# Altium project Power_PCB.PrjPcb
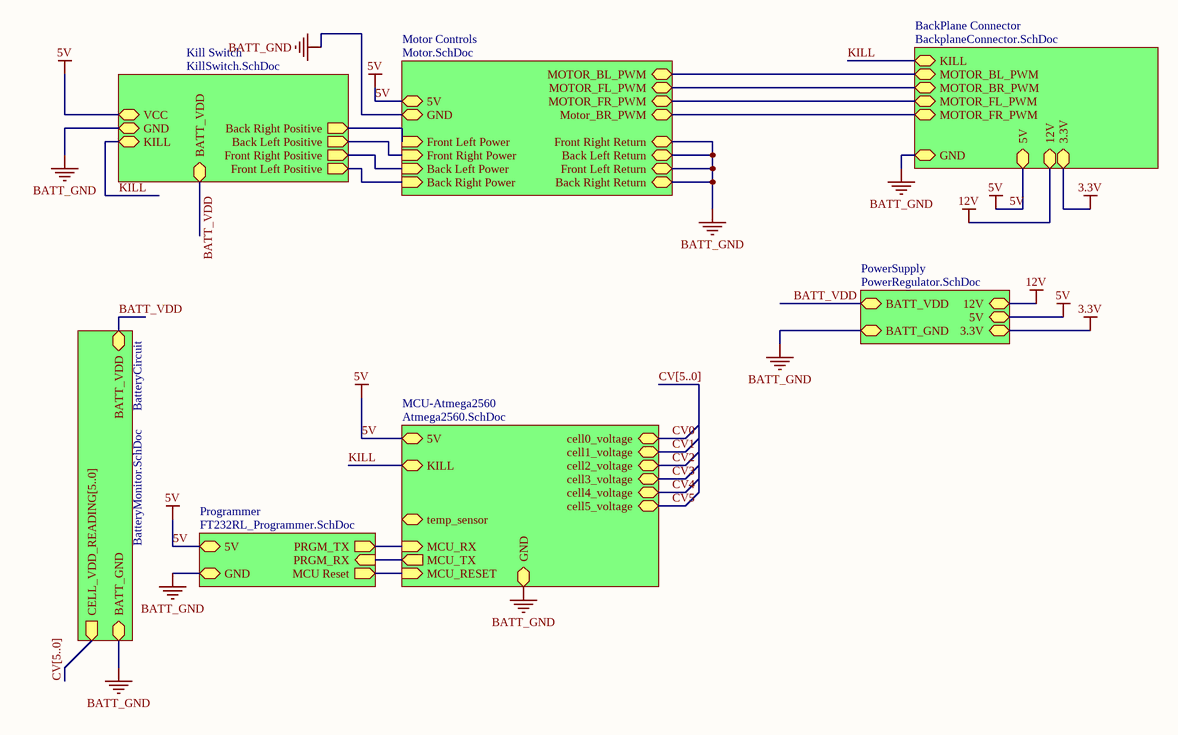
[diagram p0: Backplane.SchDoc]
11 sheets, 95 parts. Net scope: strictly hierarchical (ports join the sheet entries above them; power ports are local).
Board file: Backplane.PcbDoc
Sheets:
  Backplane.SchDoc
    Kill Switch = KillSwitch.SchDoc
    Motor Controls = Motor.SchDoc
    Programmer = FT232RL_Programmer.SchDoc
    BatteryCircuit = BatteryMonitor.SchDoc
    BackPlane Connector = BackplaneConnector.SchDoc
    MCU-Atmega2560 = Atmega2560.SchDoc
    PowerSupply = PowerRegulator.SchDoc
      U_VoltageRegulator12V = VoltageRegulator12V.schdoc
      U_VoltageRegulator3 = VoltageRegulator3.3.schdoc
      U_VoltageRegulator5V = VoltageRegulator5V.schdoc

## Sheet Backplane.SchDoc
size A4; SheetNumber: 1; SheetTotal: 2

### Sub-sheets
BackPlane Connector = BackplaneConnector.SchDoc: MOTOR_BL_PWM, MOTOR_BR_PWM, MOTOR_FL_PWM, MOTOR_FR_PWM, GND, 5V, KILL, 12V, 3.3V
BatteryCircuit = BatteryMonitor.SchDoc: BATT_VDD, BATT_GND, CELL_VDD_READING[5..0] (out)
Kill Switch = KillSwitch.SchDoc: Front Left Positive (out), Front Right Positive (out), Back Left Positive (out), Back Right Positive (out), VCC, GND, KILL (bidir), BATT_VDD
MCU-Atmega2560 = Atmega2560.SchDoc: 5V, GND, cell0_voltage (bidir), cell1_voltage (bidir), cell2_voltage (bidir), cell3_voltage (bidir), cell4_voltage (bidir), cell5_voltage (bidir), temp_sensor (bidir), MCU_TX (out), MCU_RX (in), MCU_RESET (in), KILL (bidir)
Motor Controls = Motor.SchDoc: Back Right Power (in), Back Left Power (in), Front Right Power (in), Front Left Power (in), Front Right Return, Back Left Return, Front Left Return, Back Right Return, 5V, MOTOR_BL_PWM, MOTOR_FL_PWM, MOTOR_FR_PWM, Motor_BR_PWM, GND
PowerSupply = PowerRegulator.SchDoc: BATT_VDD, 12V, 5V, 3.3V, BATT_GND
Programmer = FT232RL_Programmer.SchDoc: GND, PRGM_TX (out), PRGM_RX (in), MCU Reset (out), 5V

### Nets
3.3V: sheet BackPlane Connector/3.3V, sheet PowerSupply/3.3V
5V: sheet Kill Switch/VCC, sheet Motor Controls/5V, sheet Programmer/5V, sheet BackPlane Connector/5V, sheet MCU-Atmega2560/5V, sheet PowerSupply/5V
12V: sheet BackPlane Connector/12V, sheet PowerSupply/12V
BATT_GND: sheet Kill Switch/GND, sheet Motor Controls/Front Right Return, sheet Motor Controls/Back Left Return, sheet Motor Controls/Front Left Return, sheet Motor Controls/Back Right Return, sheet Motor Controls/GND, sheet Programmer/GND, sheet BatteryCircuit/BATT_GND, sheet BackPlane Connector/GND, sheet MCU-Atmega2560/GND, sheet PowerSupply/BATT_GND  [project net GND]
BATT_VDD: sheet Kill Switch/BATT_VDD, sheet BatteryCircuit/BATT_VDD, sheet PowerSupply/BATT_VDD
KILL: sheet Kill Switch/KILL, sheet BackPlane Connector/KILL, sheet MCU-Atmega2560/KILL
Motor_BL_Postive: sheet Kill Switch/Back Left Positive, sheet Motor Controls/Front Right Power
MOTOR_BL_PWM: sheet Motor Controls/MOTOR_BL_PWM, sheet BackPlane Connector/MOTOR_BL_PWM
Motor_BR_Postive: sheet Kill Switch/Back Right Positive, sheet Motor Controls/Front Left Power
MOTOR_BR_PWM: sheet Motor Controls/MOTOR_FL_PWM, sheet BackPlane Connector/MOTOR_BR_PWM
Motor_FL_Postive: sheet Kill Switch/Front Left Positive, sheet Motor Controls/Back Right Power
MOTOR_FL_PWM: sheet Motor Controls/MOTOR_FR_PWM, sheet BackPlane Connector/MOTOR_FL_PWM
Motor_FR_Postive: sheet Kill Switch/Front Right Positive, sheet Motor Controls/Back Left Power
MOTOR_FR_PWM: sheet Motor Controls/Motor_BR_PWM, sheet BackPlane Connector/MOTOR_FR_PWM
NetATmega2560_2: sheet Programmer/PRGM_RX, sheet MCU-Atmega2560/MCU_TX
NetATmega2560_3: sheet Programmer/PRGM_TX, sheet MCU-Atmega2560/MCU_RX
NetATmega2560_30: sheet Programmer/MCU Reset, sheet MCU-Atmega2560/MCU_RESET

### Buses and harness runs
bus CV[5..0]
bus CV[5..0] = sheet BatteryCircuit/CELL_VDD_READING[5..0]

### Notes on the sheet
- Title
- Size:
- Date:
- A4
- Number:
- Time:
- Revision:
- Sheet
- of
- File:

## Sheet KillSwitch.SchDoc: Kill Switch Circuit
size A4; Date: 4/20/2017; DrawnBy: Michael Fay; Revision: 1; SheetNumber: 2; SheetTotal: 2; File: KillSwitch.SchDoc
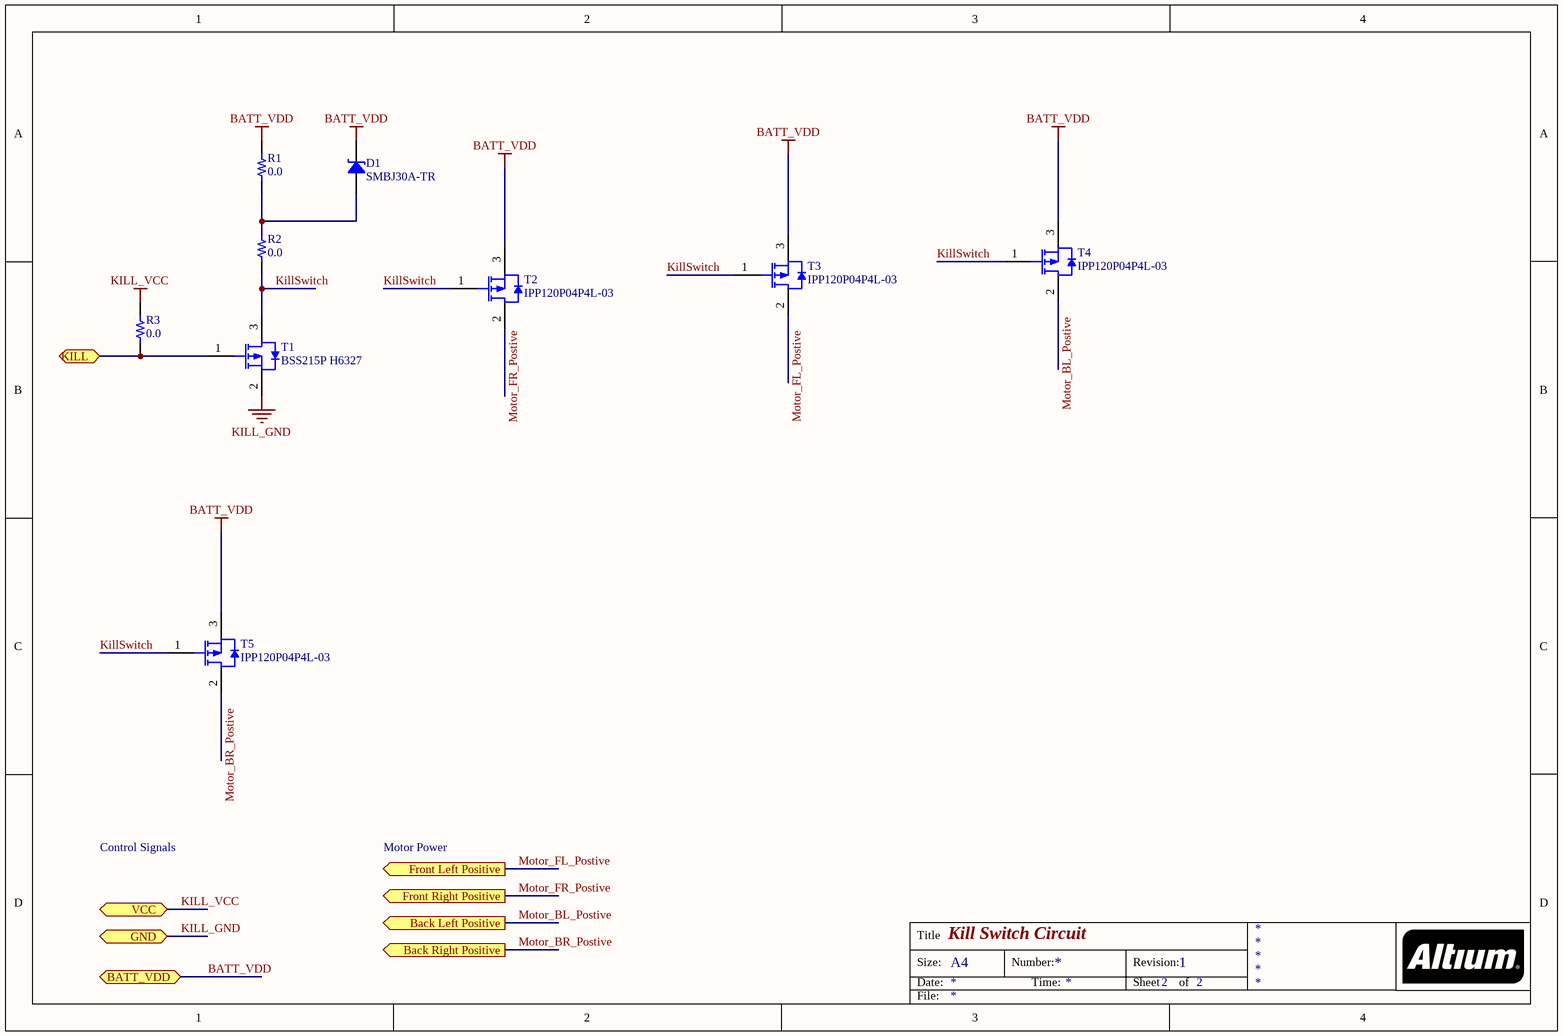
[diagram p1: KillSwitch.SchDoc]

### Parts
D1  SMBJ30A-TR  [ST DO214AA SMB]
R1  0.0  [RES 0603/1608]
R2  0.0  [RES 0603/1608]
R3  0.0  [RES 0603/1608]
T1  BSS215P H6327  [INF-PG-SOT23_N]
T2  IPP120P04P4L-03  [INF-PG-TO220-3-1]
T3  IPP120P04P4L-03  [INF-PG-TO220-3-1]
T4  IPP120P04P4L-03  [INF-PG-TO220-3-1]
T5  IPP120P04P4L-03  [INF-PG-TO220-3-1]

### Ports
Back Left Positive (out), Back Right Positive (out), BATT_VDD, Front Left Positive (out), Front Right Positive (out), GND, KILL (bidir), VCC

### Nets
BATT_VDD: D1.2 R1.2 T2.3(SOURCE) T3.3(SOURCE) T4.3(SOURCE) T5.3(SOURCE) ; port BATT_VDD
KILL_GND: T1.2(SOURCE) ; port GND  [project net GND]
KILL_VCC: R3.2 ; port VCC  [project net 5V]
KILL: R3.1 T1.1(GATE) ; port KILL
KillSwitch: R2.1 T1.3(DRAIN) T2.1(GATE) T3.1(GATE) T4.1(GATE) T5.1(GATE)
Motor_BL_Postive: T4.2(DRAIN) ; port Back Left Positive
Motor_BR_Postive: T5.2(DRAIN) ; port Back Right Positive
Motor_FL_Postive: T3.2(DRAIN) ; port Front Left Positive
Motor_FR_Postive: T2.2(DRAIN) ; port Front Right Positive
NetD1_1: D1.1 R1.1 R2.2

### Notes on the sheet
- Control Signals
- Motor Power
- Title
- Size:
- Date:
- A4
- Number:
- Time:
- Revision:
- Sheet
- of
- File:

### Library data of the parts
D1 = SMBJ30A-TR: TVS DIODE 30VWM 64.3VC SMB; Manufacturer: STMicroelectronics; Type: Zener; Unidirectional Channels: 1; Power - Peak Pulse: 600W; Current - Peak Pulse: 62A (8/20us); Voltage (Clamping): 64.3V; Voltage (Breakdown): 33.3V; Voltage (Reverse Standoff): 30V; Part Number: SMBJ30A-TR; PartId: 14620; Supplier 1: Digi-Key; Supplier Part Number 1: 497-7452-2-ND; ComponentLink1Description: Datasheet; ComponentLink1URL: http://www2.st.com/content/ccc/resource/technical/document/datasheet/19/78/91/39/07/cd/40/65/CD00001366.pdf/files/CD00001366.pdf/_jcr_content/translations/en.CD00001366.pdf; ComponentLink2Description: Digi-Key Listing; ComponentLink2URL: https://www.digikey.com/product-detail/en/stmicroelectronics/SMBJ30A-TR/497-7452-2-ND/1039140; Operating Temperature: -55C ~ 150C (TJ); Price: 0.09; Device Package: DO-214AA, SMB
R1-R3 = 5110: RES SMD 0.0 OHM JUMPER 1/2W 0603; Part Number: 5110; Manufacturer: Keystone Electronics; PowerRating: 0.5W, 1/2W; Value: 0.0; PartId: 16115; Supplier 1: Digi-Key; Supplier Part Number 1: 36-5110TR-ND; ComponentLink1Description: Datasheet; ComponentLink1URL: http://www.keyelco.com/product-pdf.cfm?p=14038; ComponentLink2Description: Digi-Key Listing; ComponentLink2URL: https://www.digikey.com/product-detail/en/keystone-electronics/5110/36-5110TR-ND/5118870; Tolerance: Jumper; Price: 0.2505; Device Package: 0603 (1608 Metric)
T1 = BSS215P H6327: P-Channel OptiMOS P2 Small-Signal-Transistor, -20 V VDS, -1.5 A ID, -55 to 150 degC, PG-SOT23, Reel, Green; Manufacturer: Infineon; Green: TRUE; ID (max): -1.5 A; IDpuls (max): -6 A; Pto t (max): 0.5 W; QG: -3.6 nC; RDS (on) (max): 280 mOhm; RDS (on) (max) (@4.5V): 150 mOhm; Rth: 250 K/W; VDS (max): -20 V; VGS(th) (max): -0.6 V; VGS(th) (min): -1.2 V; DatasheetVersion: Rev. 2.3; PackageVersion: Apr-08; PackageReference: PG-SOT23; PackageDescription: 3-Pin Small Outline Transistor Package, 2.9 x 1.3 mm Body, 0.95 mm Pitch; Supplier 1: Digi-Key; Supplier Part Number 1: BSS215P H6327TR-ND; Supplier 2: Digi-Key; Supplier Part Number 2: BSS215P H6327CT-ND; Supplier 3: Digi-Key; Supplier Part Number 3: BSS215P H6327DKR-ND; Halogen-free: TRUE; Packing: Reel; RDS (on) (max) (@2.5V): 280 mOhm; Mounting Technology: Surface Mount; PartNumber: BSS215P H6327; ComponentLink1Description: Manufacturer URL; ComponentLink1URL: http://www.infineon.com/; ComponentLink2Description: Datasheet; ComponentLink2URL: http://www.infineon.com/dgdl/BSS215P_Rev2.3.pdf?folderId=db3a304314dca38901154a72e3951a65&fileId=db3a304330f6860601311833f57144fb; ComponentLink3Description: Package Specification; ComponentLink3URL: http://www.infineon.com/dgdl/SOT23-Package_Overview.pdf?folderId=db3a30431936bc4b0119532290053c66&fileId=db3a30431936bc4b0119533468123c85
T2-T5 = IPP120P04P4L-03: OptiMOS-P2 Power-Transistor, -40 V VDS, -120 A ID, PG-TO220-3-1, Tube, Green; Manufacturer: Infineon; Green: TRUE; ID (max): -120 A; IDpuls (max): -480 A; Ptot (max): 136 W; QG: 180 nC; RDS (on) (max) (@10V): 3.4 mOhm; RDS (on) (max) (@4.5V): 5.2 mOhm; RthJC (max): 1.1 K/W; VDS (max): -40 V; VGS(th) (max): -2.2 V; VGS(th) (min): -1.2 V; DatasheetVersion: Rev. 1.0; PackageVersion: Jul-12; PackageReference: PG-TO220-3-1; PackageDescription: 3-Pin Plastic (Green) Transistor Single Outline Package, 10 x 9.25 mm Body, 2.54 mm Pitch; Supplier 1: Mouser; Supplier Part Number 1: 726-IPP120P04P4L-03; Halogen-free: TRUE; Packing: Tube; Technology: OptiMOS-P2; Mounting Technology: Through Hole; PartNumber: IPP120P04P4L-03; ComponentLink1Description: Manufacturer URL; ComponentLink1URL: http://www.infineon.com/; ComponentLink2Description: Datasheet; ComponentLink2URL: http://www.infineon.com/dgdl/IPP_B_I120P04P4L-03_DS_10.pdf?folderId=db3a304412b407950112b42b75b74520&fileId=db3a30432f69f146012f783b3b5a2e3f&location=en.Products.Automotive_ICs.Automotive_MOSFETs.Single__P-Channel_40V_MOSFETs.DATASHEET.IPP_B_I120P04P4L-03_DS_10.pdf; ComponentLink3Description: Package Specification; ComponentLink3URL: http://www.infineon.com/dgdl/BTS117_DS_14.pdf?folderId=db3a30431400ef68011421b54e2e0564&fileId=db3a30433a747525013abff8302d549c&location=en.Products.Automotive_ICs.Smart_High-_and_Low-Side_Switches.HITFET___TEMPFET__-_Smart_Low-Side_Switches.DATASHEET.BTS117_DS_14.pdf

## Sheet Motor.SchDoc
size A4
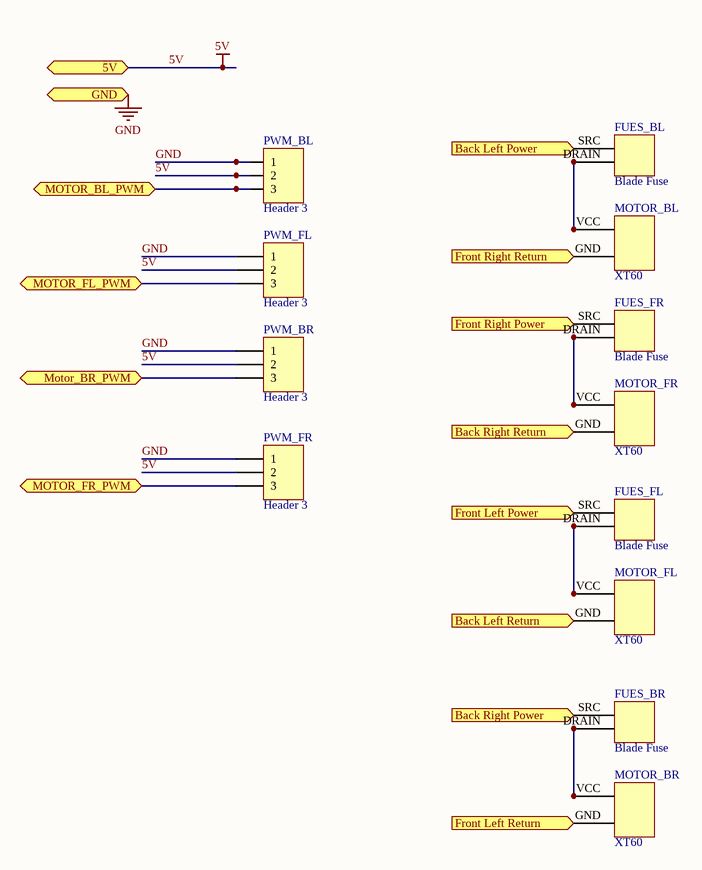
[diagram p2: Motor.SchDoc]

### Parts
FUES_BL  Blade Fuse  [Blade Fuse Holder]
FUES_BR  Blade Fuse  [Blade Fuse Holder]
FUES_FL  Blade Fuse  [Blade Fuse Holder]
FUES_FR  Blade Fuse  [Blade Fuse Holder]
MOTOR_BL  XT60  [XT60]
MOTOR_BR  XT60  [XT60]
MOTOR_FL  XT60  [XT60]
MOTOR_FR  XT60  [XT60]
PWM_BL  Header 3  [HDR1X3]
PWM_BR  Header 3  [HDR1X3]
PWM_FL  Header 3  [HDR1X3]
PWM_FR  Header 3  [HDR1X3]

### Ports
5V, Back Left Power, Back Left Return, Back Right Power, Back Right Return, Front Left Power, Front Left Return, Front Right Power, Front Right Return, GND, MOTOR_BL_PWM, Motor_BR_PWM, MOTOR_FL_PWM, MOTOR_FR_PWM

### Nets
5V: PWM_BL.2 PWM_BR.2 PWM_FL.2 PWM_FR.2 ; port 5V
GND: MOTOR_BL.GND MOTOR_BR.GND MOTOR_FL.GND MOTOR_FR.GND PWM_BL.1 PWM_BR.1 PWM_FL.1 PWM_FR.1 ; port Front Right Return, port Back Left Return, port Front Left Return, port Back Right Return, port GND
Motor_BL_Postive: FUES_FR.SRC ; port Front Right Power
MOTOR_BL_PWM: PWM_BL.3 ; port MOTOR_BL_PWM
Motor_BR_Postive: FUES_FL.SRC ; port Front Left Power
MOTOR_BR_PWM: PWM_FL.3 ; port MOTOR_FL_PWM
Motor_FL_Postive: FUES_BR.SRC ; port Back Right Power
MOTOR_FL_PWM: PWM_FR.3 ; port MOTOR_FR_PWM
Motor_FR_Postive: FUES_BL.SRC ; port Back Left Power
MOTOR_FR_PWM: PWM_BR.3 ; port Motor_BR_PWM
NetFUES_BL_DRAIN: FUES_BL.DRAIN MOTOR_BL.VCC
NetFUES_BR_DRAIN: FUES_BR.DRAIN MOTOR_BR.VCC
NetFUES_FL_DRAIN: FUES_FL.DRAIN MOTOR_FL.VCC
NetFUES_FR_DRAIN: FUES_FR.DRAIN MOTOR_FR.VCC

### Notes on the sheet
- Title
- Size:
- Date:
- A4
- Number:
- Time:
- Revision:
- Sheet
- of
- File:

### Library data of the parts
PWM_BL PWM_BR PWM_FL PWM_FR = Header 3: Header, 3-Pin; LatestRevisionDate: 17-Jul-2002; LatestRevisionNote: Re-released for DXP Platform.; Publisher: Altium Limited

## Sheet FT232RL_Programmer.SchDoc
size A4
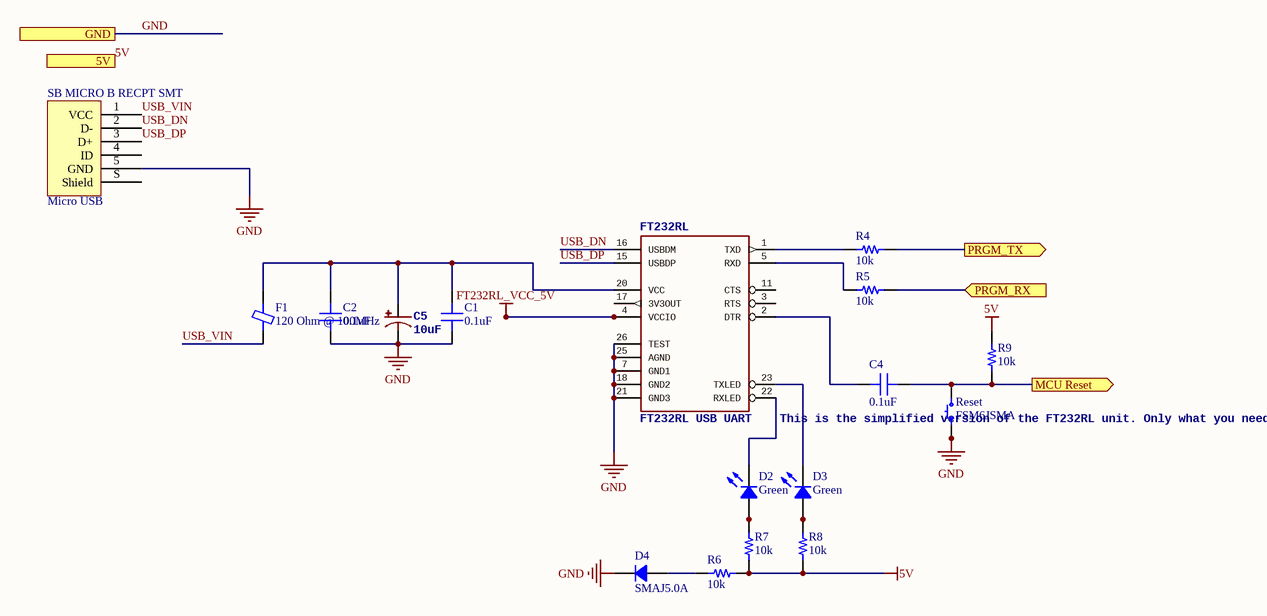
[diagram p3: FT232RL_Programmer.SchDoc]

### Parts
C1  0.1uF  [CAP 0402/1005]
C2  0.1uF  [CAP 0402/1005]
C4  0.1uF  [CAP 0402/1005]
C5  10uF  [CPOL-RADIAL-5MM-10MM-KIT]
D2  Green  [LED 0603/1608 GREEN]
D3  Green  [LED 0603/1608 GREEN]
D4  SMAJ5.0A  [DO214AC SMA]
F1  120 Ohm @ 100MHz  [FER 0201/0603]
FT232RL  FT232RL USB UART    This is the simplified version of the FT232RL unit. Only what you need, nothing you don't.   FT232RL 4th Generation USB UART (USB <-> Serial) Controller.   Datasheet SparkFun Products  Component (COM-00650)  SparkFun RedBot Mainboard (ROB-12097)  SparkFun FTDI Basic Breakout - 5V (DEV-09716)  SparkFun FTDI Basic Breakout - 3.3V (DEV-09873)  Bus Pirate - v3.6a (TOL-12942)  SparkFun USB to Serial Breakout - FT232RL (BOB-12731)  SparkFun PicoBoard (WIG-11888)  SparkFun RFID USB Reader (SEN-09963)  LilyPad FTDI Basic Breakout - 5V (DEV-10275)  SparkFun Stepoko (ROB-13899)  [SSOP28DB]
R4  10k  [RES 0402/1005]
R5  10k  [RES 0402/1005]
R6  10k  [RES 0402/1005]
R7  10k  [RES 0402/1005]
R8  10k  [RES 0402/1005]
R9  10k  [RES 0402/1005]
Reset  FSM6JSMA  [TE FSM6JSMA]
SB_MICRO_B_RECPT_SMT  Micro USB  [FCI USB 10118193-0001LF]

### Ports
5V, GND, MCU Reset (out), PRGM_RX (in), PRGM_TX (out)

### Nets
5V: R6.1 R7.1 R8.1 R9.2 ; port 5V
FT232RL_VCC_5V: FT232RL.4(VCCIO)
GND: C1.1 C2.1 C5.- D4.2 FT232RL.7(GND1) FT232RL.18(GND2) FT232RL.21(GND3) FT232RL.25(AGND) FT232RL.26(TEST) Reset.1 Reset.2 SB_MICRO_B_RECPT_SMT.5(GND) ; port GND
USB_DN: FT232RL.16(USBDM) SB_MICRO_B_RECPT_SMT.2(D-)
USB_DP: FT232RL.15(USBDP) SB_MICRO_B_RECPT_SMT.3(D+)
USB_VIN: F1.1 SB_MICRO_B_RECPT_SMT.1(VCC)
NetATmega2560_2: R5.2 ; port PRGM_RX
NetATmega2560_3: R4.2 ; port PRGM_TX
NetATmega2560_30: C4.2 R9.1 Reset.3 Reset.4 ; port MCU Reset
NetC1_2: C1.2 C2.2 C5.+ F1.2 FT232RL.20(VCC)
NetC4_1: C4.1 FT232RL.2(DTR)
NetD2_1: D2.1 R7.2
NetD2_2: D2.2 FT232RL.22(RXLED)
NetD3_1: D3.1 R8.2
NetD3_2: D3.2 FT232RL.23(TXLED)
NetD4_1: D4.1 R6.2
NetFT232RL_1: FT232RL.1(TXD) R4.1
NetFT232RL_5: FT232RL.5(RXD) R5.1

Not connected (* = marked no-connect by the designer): FT232RL 3(RTS) 11(CTS) 17(3V3OUT); SB_MICRO_B_RECPT_SMT 4(ID) S(Shield)

### Notes on the sheet
- Title
- Size:
- Date:
- A4
- Number:
- Time:
- Revision:
- Sheet
- of
- File:

### Library data of the parts
C1 C2 C4 = C1005X7R1C104K050BC: CAP CER 0.1UF 16V X7R 0402; Manufacturer: TDK Corporation; TemperatureRange: -55C ~ 125C; Tolerance: 10%; Value: 0.1uF; Part Number: C1005X7R1C104K050BC; PartId: 3856; Supplier 1: Digi-Key; Supplier Part Number 1: 445-4952-2-ND; ComponentLink1Description: Datasheet; ComponentLink1URL: https://product.tdk.com/info/en/catalog/datasheets/mlcc_commercial_general_en.pdf; ComponentLink2Description: Digi-Key listing; ComponentLink2URL: http://digikey.com/product-detail/en/C1005X7R1C104K050BC/445-4952-2-ND/2093220; TemperatureCoefficient: X7R; Voltage: 16V; Price: 0.0066; Type: -; Device Package: 0402 (1005 Metric)
C5 = 1000UF-RADIAL-5MM-35V-20%-KIT: PROD_ID: CAP-09538
D2 D3 = LTST-C191KGKT: LED GREEN CLEAR 0603 SMD; Manufacturer: Lite-On Inc.; Type: Surface Mount; Millicandela: 35mcd; Voltage Forward: 2V; Current (Test): 20mA; Viewing Angle: 130; Value: Green; Part Number: LTST-C191KGKT; PartId: 7051; Supplier 1: Digi-Key; Supplier Part Number 1: 160-1446-2-ND; ComponentLink1Description: Datasheet; ComponentLink1URL: http://optoelectronics.liteon.com/upload/download/DS22-2000-228/S_110_LTST-C191KGKT.pdf; ComponentLink2Description: Digi-Key Listing; ComponentLink2URL: http://www.digikey.ca/product-detail/en/LTST-C191KGKT/160-1446-2-ND/386835; Price: 0.0521; Device Package: 0603 (1608 Metric); Colour: Green; Lens Transparency: Clear
D4 = SMAJ5.0A: TVS DIODE 5VWM 9.2VC SMA; Manufacturer: Littelfuse Inc.; Type: Surface Mount; Power - Peak Pulse: 400W; Current - Peak Pulse: 43.5A; Voltage (Clamping): 9.2V; Voltage (Breakdown): 6.4V; Voltage (Reverse Standoff): 5V; Part Number: SMAJ5.0A; PartId: 7757; Supplier 1: Digi-Key; Supplier Part Number 1: SMAJ5.0ALFTR-ND; ComponentLink1Description: Datasheet; ComponentLink1URL: http://www.littelfuse.com/~/media/electronics/datasheets/tvs_diodes/littelfuse_tvs_diode_smaj_datasheet.pdf.pdf; ComponentLink2Description: Digi-Key Listing; ComponentLink2URL: http://www.digikey.ca/product-detail/en/SMAJ5.0A/SMAJ5.0ALFTR-ND/762250; Operating Temperature: -55C ~ 150C (TJ); Price: 0.1626; Device Package: DO-214AC, SMA
F1 = BLM03AG121SN1D: FERRITE BEAD 120 OHM 0201 1LN; Manufacturer: Murata Electronics North America; DC Resistance: 500 mOhm; Current Rating: 200mA; Part Number: BLM03AG121SN1D; PartId: 20352; Value: 120 Ohm @ 100MHz; Supplier 1: Digi-Key; Supplier Part Number 1: 490-2557-2-ND; ComponentLink1Description: Datasheet; ComponentLink1URL: http://search.murata.co.jp/Ceramy/image/img/PDF/ENG/L0110S0100BLM03AG.pdf; ComponentLink2Description: Digi-Key Listing; ComponentLink2URL: https://www.digikey.com/product-detail/en/murata-electronics-north-america/BLM03AG121SN1D/490-2557-2-ND/610979; Price: 0.03; Device Package: 0201 (0603 Metric)
FT232RL = FT232RL-BASICSSOP: PROD_ID: IC-00870
R4-R9 = ERJ-2RKF1002X: RES SMD 10K OHM 1% 1/10W 0402; Manufacturer: Panasonic Electronic Components; TemperatureRange: -55C ~ 155C; TemperatureCoefficient: 100ppm/C; PowerRating: 0.1W, 1/10W; Value: 10k; Part Number: ERJ-2RKF1002X; PartId: 1; Supplier 1: Digi-Key; Supplier Part Number 1: P10.0KLTR-ND; ComponentLink1Description: Datasheet; ComponentLink1URL: http://industrial.panasonic.com/www-cgi/jvcr13pz.cgi?E+PZ+3+AOA0002+ERJ2RKF1002X+7+WW; ComponentLink2Description: Digikey listing; ComponentLink2URL: http://digikey.com/product-detail/en/ERJ-2RKF1002X/P10.0KLTR-ND/192073; Tolerance: 1%; Price: 0.0043; Type: Thick Film; Device Package: 0402 (1005 Metric)
Reset = FSM6JSMA: SWITCH TACTILE SPST-NO 0.05A 24V; Manufacturer: TE Connectivity Alcoswitch Switches; Switch Function: Off-Mom; Contact Rating @ Voltage: 0.05A @ 24VDC; Actuator Type: Standard; Actuator Orientation: Top Actuated; Illumination: Non-Illuminated; Operating Force: 160gf; Switch Travel: 0.25mm; Mechanical Life: 100,000 Cycles; Part Number: FSM6JSMA; PartId: 7910; Supplier 1: Digi-Key; Supplier Part Number 1: 450-1133-ND; ComponentLink1Description: Datasheet; ComponentLink1URL: http://www.te.com/commerce/DocumentDelivery/DDEController?Action=srchrtrv&DocNm=2-1437565-7&DocType=Customer+Drawing&DocLang=English; ComponentLink2Description: Digi-Key Listing; ComponentLink2URL: http://www.digikey.com/product-detail/en/FSM6JSMA/450-1133-ND/525822; Price: 0.24; Circuit: SPST-NO; Illumination Voltage: -; Illumination Type, Colour: -; Operating Temperature: -35C ~ 85C
SB_MICRO_B_RECPT_SMT = 10118193-0001LF: CONN USB MICRO B RECPT SMT R/A; Manufacturer: FCI; Number Of Positions: 5; Part Number: 10118193-0001LF; PartId: 7864; Supplier 1: Digi-Key; Supplier Part Number 1: 609-4616-2-ND; ComponentLink1Description: Datasheet; ComponentLink1URL: http://portal.fciconnect.com/Comergent//fci/drawing/10118193.pdf; ComponentLink2Description: Digi-Key Listing; ComponentLink2URL: http://www.digikey.ca/product-detail/en/10118193-0001LF/609-4616-2-ND/2785388; Price: 0.2823; Type: USB - micro B; Series: USB 2.0

## Sheet BatteryMonitor.SchDoc
size A4
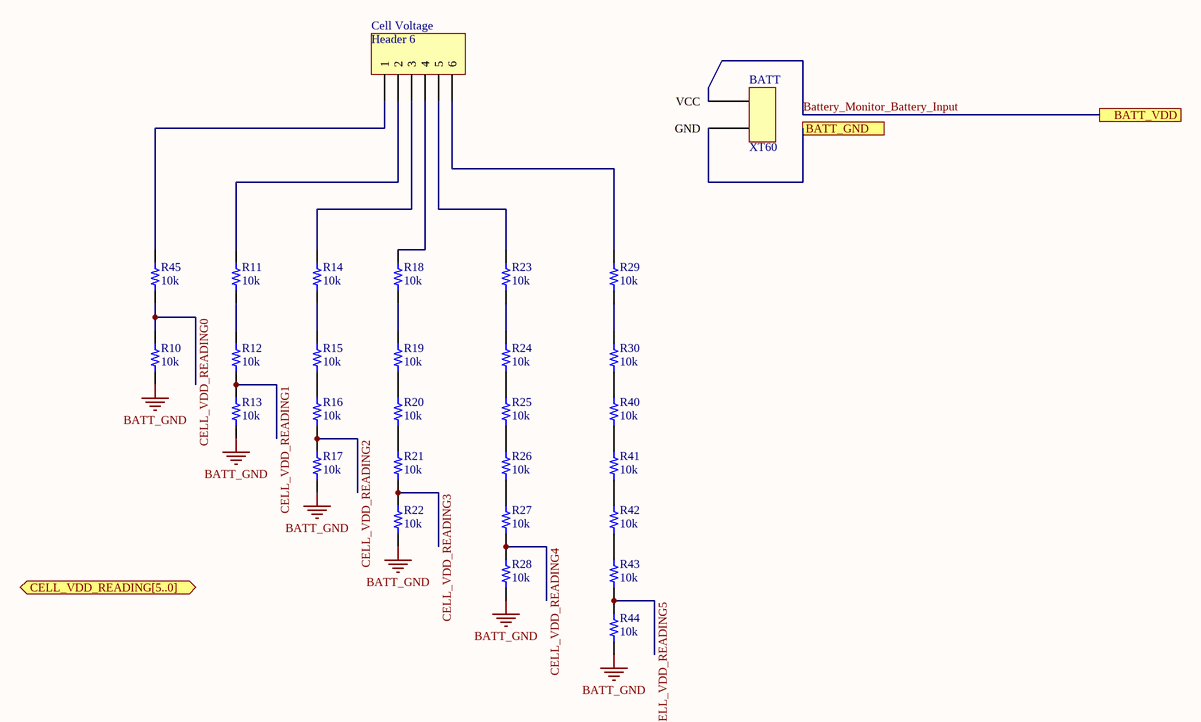
[diagram p4: BatteryMonitor.SchDoc]

### Parts
BATT  XT60  [XT60]
Cell_Voltage  Header 6  [HDR1X6]
R10  10k  [RES 0402/1005]
R11  10k  [RES 0402/1005]
R12  10k  [RES 0402/1005]
R13  10k  [RES 0402/1005]
R14  10k  [RES 0402/1005]
R15  10k  [RES 0402/1005]
R16  10k  [RES 0402/1005]
R17  10k  [RES 0402/1005]
R18  10k  [RES 0402/1005]
R19  10k  [RES 0402/1005]
R20  10k  [RES 0402/1005]
R21  10k  [RES 0402/1005]
R22  10k  [RES 0402/1005]
R23  10k  [RES 0402/1005]
R24  10k  [RES 0402/1005]
R25  10k  [RES 0402/1005]
R26  10k  [RES 0402/1005]
R27  10k  [RES 0402/1005]
R28  10k  [RES 0402/1005]
R29  10k  [RES 0402/1005]
R30  10k  [RES 0402/1005]
R40  10k  [RES 0402/1005]
R41  10k  [RES 0402/1005]
R42  10k  [RES 0402/1005]
R43  10k  [RES 0402/1005]
R44  10k  [RES 0402/1005]
R45  10k  [RES 0402/1005]

### Ports
BATT_GND, BATT_VDD, CELL_VDD_READING[5..0]

### Nets
BATT_GND: R10.1 R13.1 R17.1 R22.1 R28.1 R44.1
CELL_VDD_READING0: R10.2 R45.1
CELL_VDD_READING1: R12.1 R13.2
CELL_VDD_READING2: R16.1 R17.2
CELL_VDD_READING3: R21.1 R22.2
CELL_VDD_READING4: R27.1 R28.2
CELL_VDD_READING5: R43.1 R44.2
NetCell_Voltage_1: Cell_Voltage.1 R45.2
NetCell_Voltage_2: Cell_Voltage.2 R11.2
NetCell_Voltage_3: Cell_Voltage.3 R14.2
NetCell_Voltage_4: Cell_Voltage.4 R18.2
NetCell_Voltage_5: Cell_Voltage.5 R23.2
NetCell_Voltage_6: Cell_Voltage.6 R29.2
NetR11_1: R11.1 R12.2
NetR14_1: R14.1 R15.2
NetR15_1: R15.1 R16.2
NetR18_1: R18.1 R19.2
NetR19_1: R19.1 R20.2
NetR20_1: R20.1 R21.2
NetR23_1: R23.1 R24.2
NetR24_1: R24.1 R25.2
NetR25_1: R25.1 R26.2
NetR26_1: R26.1 R27.2
NetR29_1: R29.1 R30.2
NetR30_1: R30.1 R40.2
NetR40_1: R40.1 R41.2
NetR41_1: R41.1 R42.2
NetR42_1: R42.1 R43.2

Not connected (* = marked no-connect by the designer): BATT GND VCC

### Notes on the sheet
- Title
- Size:
- Date:
- A4
- Number:
- Time:
- Revision:
- Sheet
- of
- File:

### Library data of the parts
Cell_Voltage = Header 6: Header, 6-Pin; LatestRevisionDate: 17-Jul-2002; LatestRevisionNote: Re-released for DXP Platform.; Publisher: Altium Limited
R10-R30 R40-R45 = ERJ-2RKF1002X: as R4 on sheet FT232RL_Programmer; Value: 10k; Part Number: ERJ-2RKF1002X; PartId: 1; Supplier 1: Digi-Key; Supplier Part Number 1: P10.0KLTR-ND; ComponentLink1Description: Datasheet; ComponentLink1URL: http://industrial.panasonic.com/www-cgi/jvcr13pz.cgi?E+PZ+3+AOA0002+ERJ2RKF1002X+7+WW; ComponentLink2Description: Digikey listing; ComponentLink2URL: http://digikey.com/product-detail/en/ERJ-2RKF1002X/P10.0KLTR-ND/192073; Tolerance: 1%; Price: 0.0043; Type: Thick Film; Device Package: 0402 (1005 Metric)

## Sheet BackplaneConnector.SchDoc
size B
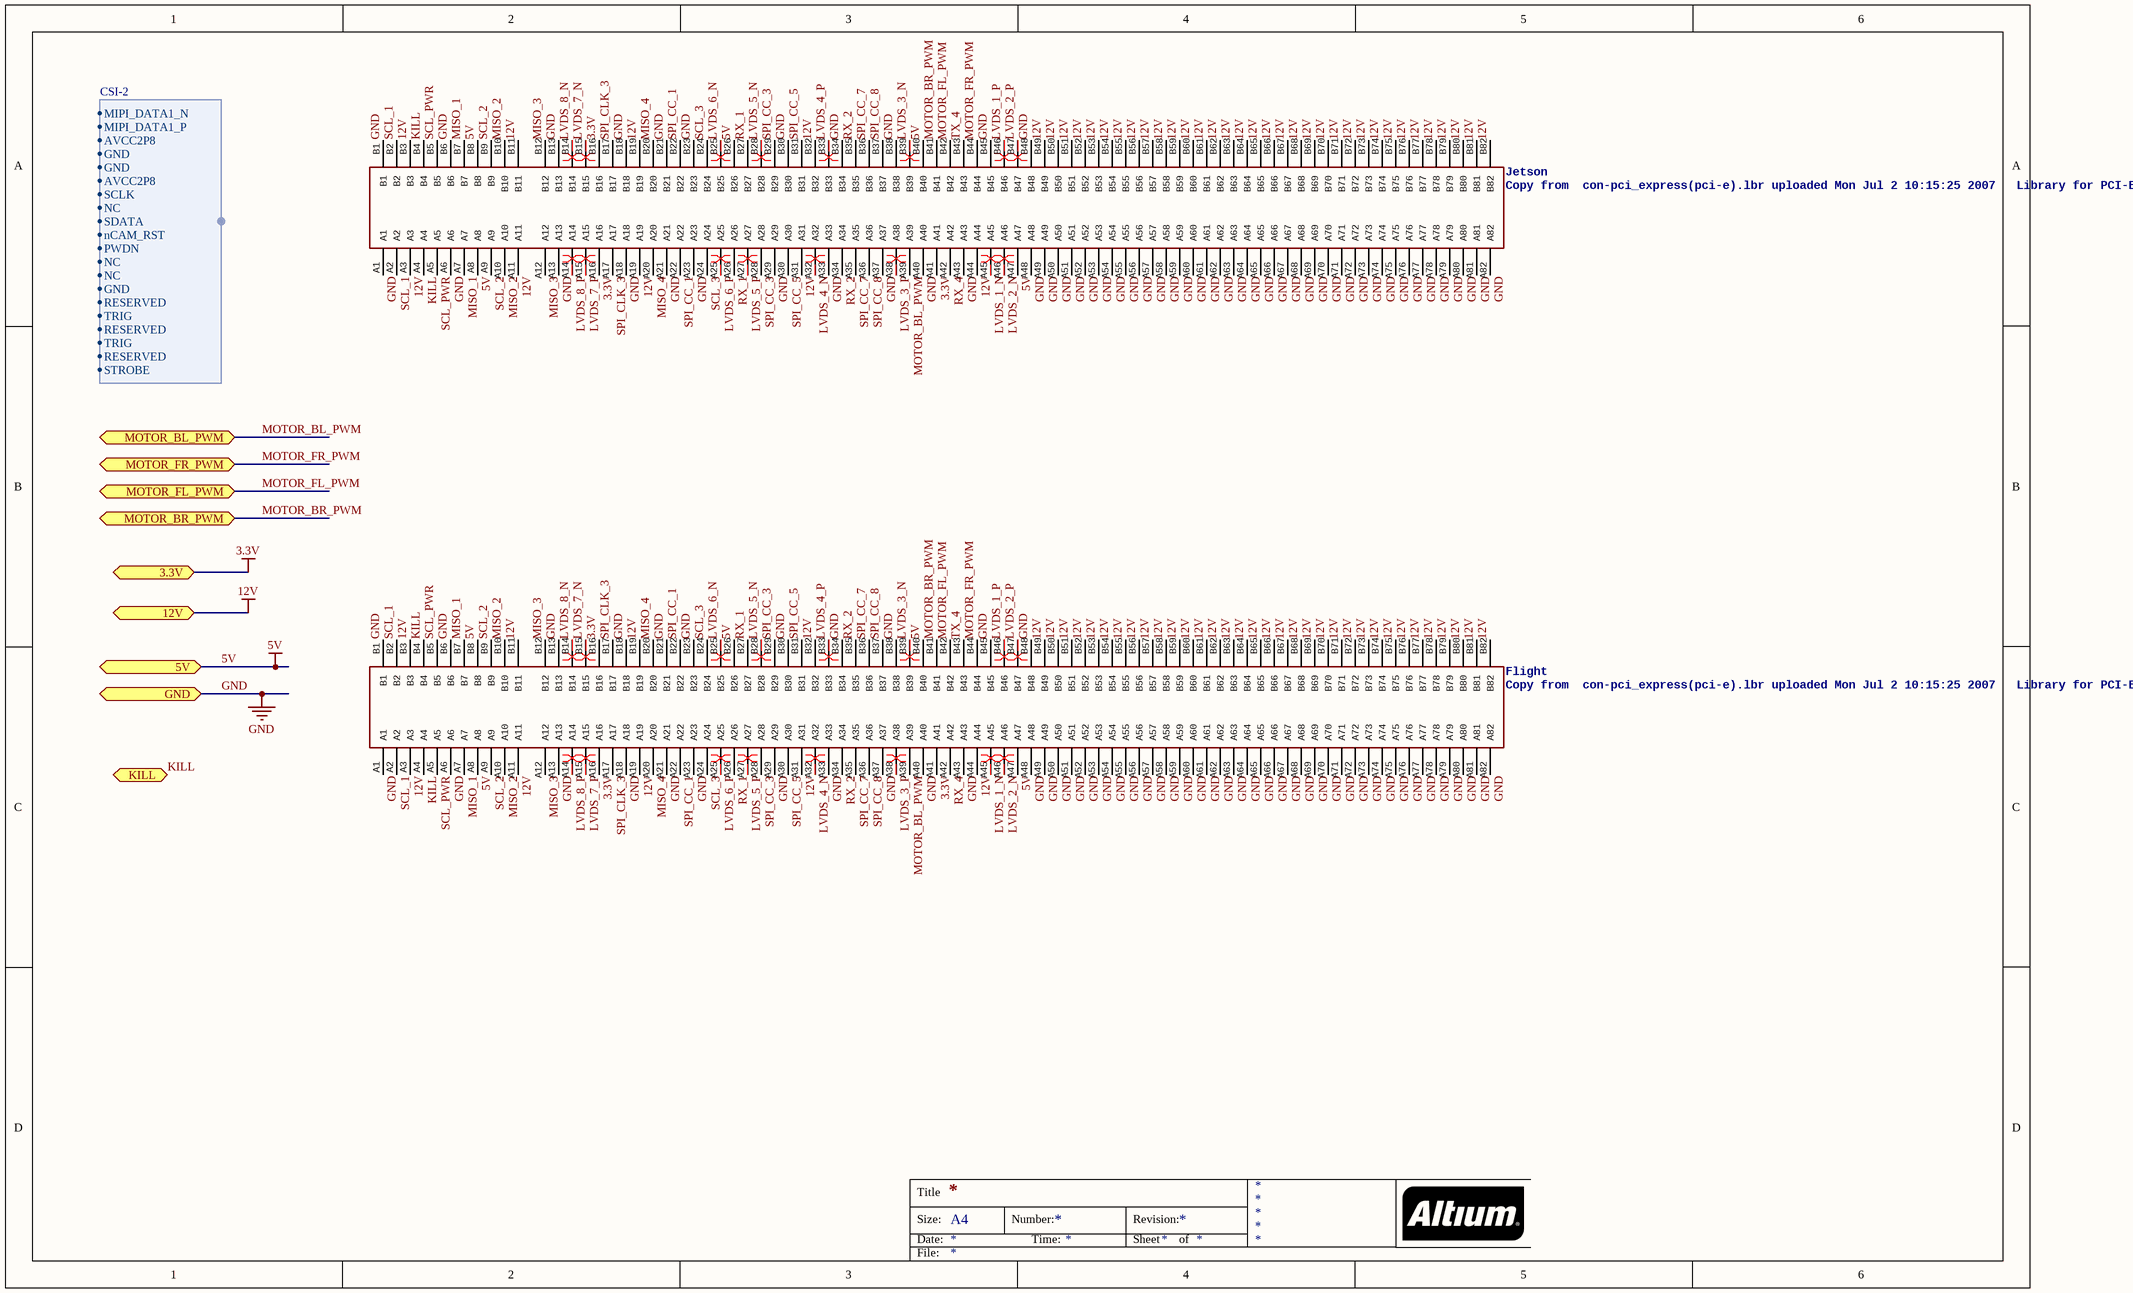
[diagram p5: BackplaneConnector.SchDoc]

### Parts
Flight  Copy from  con-pci_express(pci-e).lbr uploaded Mon Jul 2 10:15:25 2007   Library for PCI-Express x16 (PCI-E) connector. Includes connector and card edge pattern. Uploaded by JF Duval <jfduval@aqra.ca> from AQRA.ca  [PCI-E-164]
Jetson  Copy from  con-pci_express(pci-e).lbr uploaded Mon Jul 2 10:15:25 2007   Library for PCI-Express x16 (PCI-E) connector. Includes connector and card edge pattern. Uploaded by JF Duval <jfduval@aqra.ca> from AQRA.ca  [PCI-E-164]

### Ports
3.3V, 5V, 12V, GND, KILL, MOTOR_BL_PWM, MOTOR_BR_PWM, MOTOR_FL_PWM, MOTOR_FR_PWM

### Harnesses
CSI-2: AVCC2P8, MIPI_DATA1_N, MIPI_DATA1_P, AVCC2P8, GND, GND, SCLK, NC, SDATA, nCAM_RST, PWDN, NC, NC, GND, RESERVED, TRIG, RESERVED, TRIG, RESERVED, STROBE

### Nets
3.3V: Flight.A16 Flight.A41 Flight.B16 Jetson.A16 Jetson.A41 Jetson.B16 ; port 3.3V
5V: Flight.A8 Flight.A47 Flight.B8 Flight.B26 Flight.B40 Jetson.A8 Jetson.A47 Jetson.B8 Jetson.B26 Jetson.B40 ; port 5V
12V: Flight.A3 Flight.A11 Flight.A19 Flight.A31 Flight.A44 Flight.B3 Flight.B11 Flight.B19 Flight.B32 Flight.B49 Flight.B50 Flight.B51 Flight.B52 Flight.B53 Flight.B54 Flight.B55 Flight.B56 Flight.B57 Flight.B58 Flight.B59 Flight.B60 Flight.B61 Flight.B62 Flight.B63 Flight.B64 Flight.B65 Flight.B66 Flight.B67 Flight.B68 Flight.B69 Flight.B70 Flight.B71 Flight.B72 Flight.B73 Flight.B74 Flight.B75 Flight.B76 Flight.B77 Flight.B78 Flight.B79 Flight.B80 Flight.B81 Flight.B82 Jetson.A3 Jetson.A11 Jetson.A19 Jetson.A31 Jetson.A44 Jetson.B3 Jetson.B11 Jetson.B19 Jetson.B32 Jetson.B49 Jetson.B50 Jetson.B51 Jetson.B52 Jetson.B53 Jetson.B54 Jetson.B55 Jetson.B56 Jetson.B57 Jetson.B58 Jetson.B59 Jetson.B60 Jetson.B61 Jetson.B62 Jetson.B63 Jetson.B64 Jetson.B65 Jetson.B66 Jetson.B67 Jetson.B68 Jetson.B69 Jetson.B70 Jetson.B71 Jetson.B72 Jetson.B73 Jetson.B74 Jetson.B75 Jetson.B76 Jetson.B77 Jetson.B78 Jetson.B79 Jetson.B80 Jetson.B81 Jetson.B82 ; port 12V
GND: Flight.A1 Flight.A6 Flight.A13 Flight.A18 Flight.A21 Flight.A23 Flight.A29 Flight.A33 Flight.A37 Flight.A40 Flight.A43 Flight.A48 Flight.A49 Flight.A50 Flight.A51 Flight.A52 Flight.A53 Flight.A54 Flight.A55 Flight.A56 Flight.A57 Flight.A58 Flight.A59 Flight.A60 Flight.A61 Flight.A62 Flight.A63 Flight.A64 Flight.A65 Flight.A66 Flight.A67 Flight.A68 Flight.A69 Flight.A70 Flight.A71 Flight.A72 Flight.A73 Flight.A74 Flight.A75 Flight.A76 Flight.A77 Flight.A78 Flight.A79 Flight.A80 Flight.A81 Flight.A82 Flight.B1 Flight.B6 Flight.B13 Flight.B18 Flight.B21 Flight.B23 Flight.B30 Flight.B34 Flight.B38 Flight.B45 Flight.B48 Jetson.A1 Jetson.A6 Jetson.A13 Jetson.A18 Jetson.A21 Jetson.A23 Jetson.A29 Jetson.A33 Jetson.A37 Jetson.A40 Jetson.A43 Jetson.A48 Jetson.A49 Jetson.A50 Jetson.A51 Jetson.A52 Jetson.A53 Jetson.A54 Jetson.A55 Jetson.A56 Jetson.A57 Jetson.A58 Jetson.A59 Jetson.A60 Jetson.A61 Jetson.A62 Jetson.A63 Jetson.A64 Jetson.A65 Jetson.A66 Jetson.A67 Jetson.A68 Jetson.A69 Jetson.A70 Jetson.A71 Jetson.A72 Jetson.A73 Jetson.A74 Jetson.A75 Jetson.A76 Jetson.A77 Jetson.A78 Jetson.A79 Jetson.A80 Jetson.A81 Jetson.A82 Jetson.B1 Jetson.B6 Jetson.B13 Jetson.B18 Jetson.B21 Jetson.B23 Jetson.B30 Jetson.B34 Jetson.B38 Jetson.B45 Jetson.B48 ; port GND
KILL: Flight.A4 Flight.B4 Jetson.A4 Jetson.B4 ; port KILL
LVDS_1_N: Flight.A45 Jetson.A45
LVDS_1_P: Flight.B46 Jetson.B46
LVDS_2_N: Flight.A46 Jetson.A46
LVDS_2_P: Flight.B47 Jetson.B47
LVDS_3_N: Flight.B39 Jetson.B39
LVDS_3_P: Flight.A38 Jetson.A38
LVDS_4_N: Flight.A32 Jetson.A32
LVDS_4_P: Flight.B33 Jetson.B33
LVDS_5_N: Flight.B28 Jetson.B28
LVDS_5_P: Flight.A27 Jetson.A27
LVDS_6_N: Flight.B25 Jetson.B25
LVDS_6_P: Flight.A25 Jetson.A25
LVDS_7_N: Flight.B15 Jetson.B15
LVDS_7_P: Flight.A15 Jetson.A15
LVDS_8_N: Flight.B14 Jetson.B14
LVDS_8_P: Flight.A14 Jetson.A14
MISO_1: Flight.A7 Flight.B7 Jetson.A7 Jetson.B7
MISO_2: Flight.A10 Flight.B10 Jetson.A10 Jetson.B10
MISO_3: Flight.A12 Flight.B12 Jetson.A12 Jetson.B12
MISO_4: Flight.A20 Flight.B20 Jetson.A20 Jetson.B20
MOTOR_BL_PWM: Flight.A39 Jetson.A39 ; port MOTOR_BL_PWM
MOTOR_BR_PWM: Flight.B41 Jetson.B41 ; port MOTOR_BR_PWM
MOTOR_FL_PWM: Flight.B42 Jetson.B42 ; port MOTOR_FL_PWM
MOTOR_FR_PWM: Flight.B44 Jetson.B44 ; port MOTOR_FR_PWM
RX_1: Flight.A26 Flight.B27 Jetson.A26 Jetson.B27
RX_2: Flight.A34 Flight.B35 Jetson.A34 Jetson.B35
RX_4: Flight.A42 Jetson.A42
SCL_1: Flight.A2 Flight.B2 Jetson.A2 Jetson.B2
SCL_2: Flight.A9 Flight.B9 Jetson.A9 Jetson.B9
SCL_3: Flight.A24 Flight.B24 Jetson.A24 Jetson.B24
SCL_PWR: Flight.A5 Flight.B5 Jetson.A5 Jetson.B5
SPI_CC_1: Flight.A22 Flight.B22 Jetson.A22 Jetson.B22
SPI_CC_3: Flight.A28 Flight.B29 Jetson.A28 Jetson.B29
SPI_CC_5: Flight.A30 Flight.B31 Jetson.A30 Jetson.B31
SPI_CC_7: Flight.A35 Flight.B36 Jetson.A35 Jetson.B36
SPI_CC_8: Flight.A36 Flight.B37 Jetson.A36 Jetson.B37
SPI_CLK_3: Flight.A17 Flight.B17 Jetson.A17 Jetson.B17
TX_4: Flight.B43 Jetson.B43

### Layout directives
differential pair: LVDS_1_N, LVDS_1_P, LVDS_2_N, LVDS_2_P, LVDS_3_N, LVDS_3_P, LVDS_4_N, LVDS_4_P, LVDS_5_N, LVDS_5_P, LVDS_6_N, LVDS_6_P, LVDS_7_N, LVDS_7_P, LVDS_8_N, LVDS_8_P

### Notes on the sheet
- Title
- Size:
- Date:
- A4
- Number:
- Time:
- Revision:
- Sheet
- of
- File:

### Library data of the parts
Flight Jetson = PCI-E-164SOCKET

## Sheet Atmega2560.SchDoc
size A4
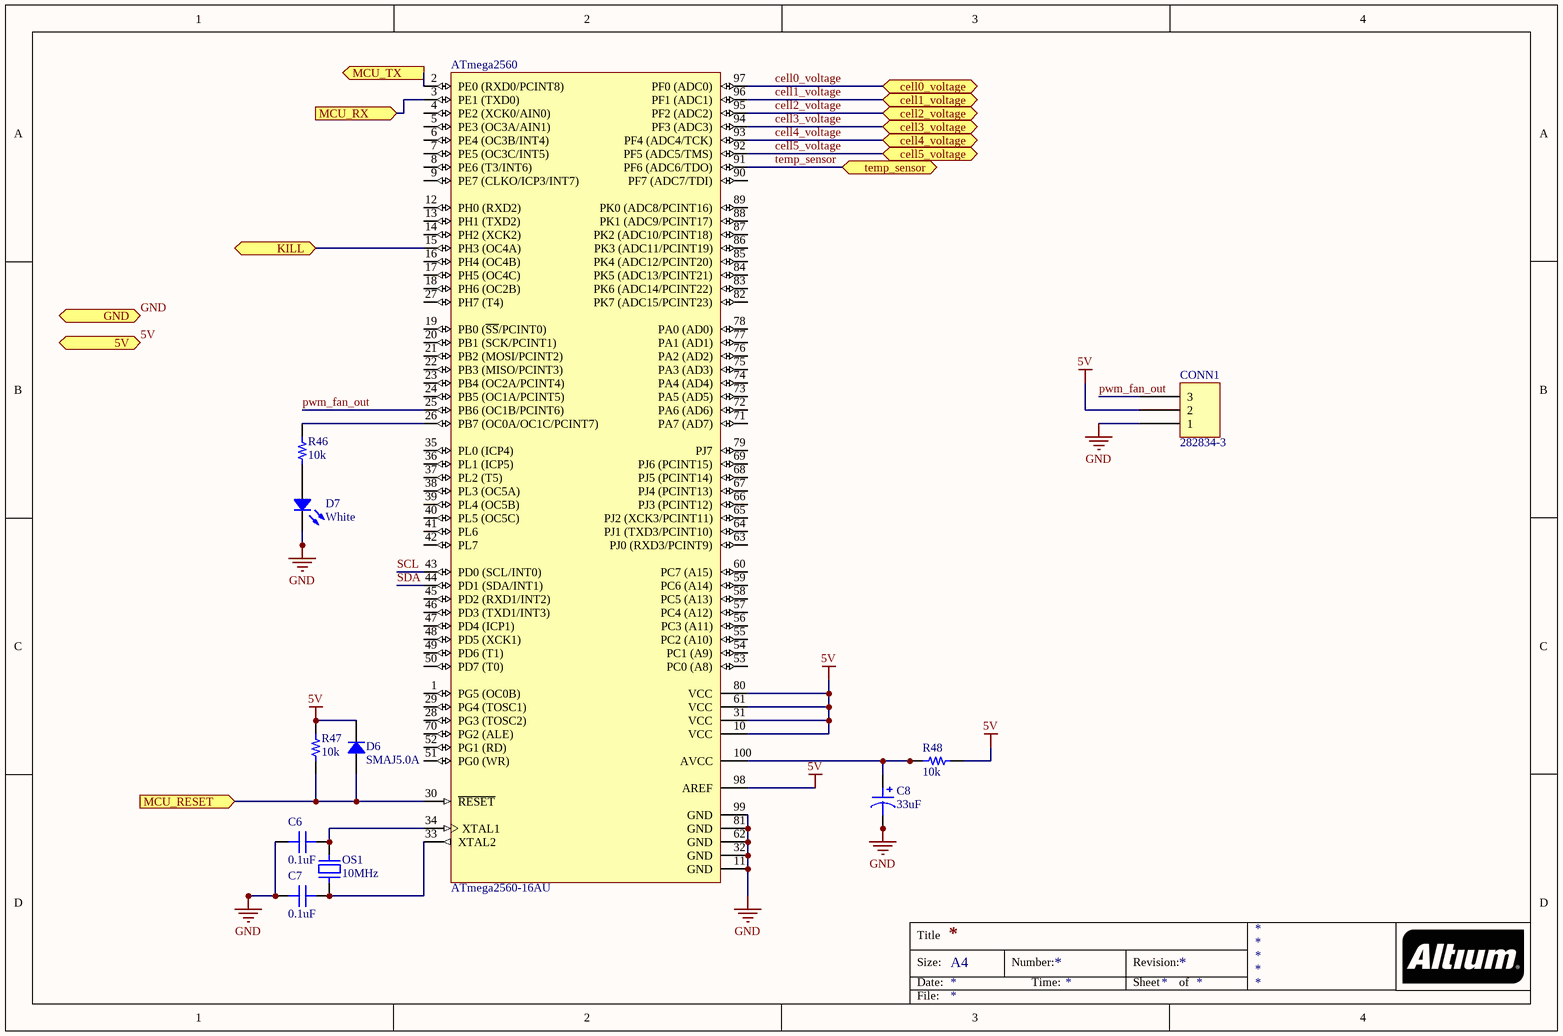
[diagram p6: Atmega2560.SchDoc]

### Parts
ATmega2560  ATmega2560-16AU  [100A_N]
C6  0.1uF  [CAP 0402/1005]
C7  0.1uF  [CAP 0402/1005]
C8  33uF  [CAP ALUM 6.6MM]
CONN1  282834-3  [TE 282834-3]
D6  SMAJ5.0A  [DO214AC SMA]
D7  White  [LED 0603/1608]
OS1  10MHz  [NDK NX5032GA]
R46  10k  [RES 0402/1005]
R47  10k  [RES 0402/1005]
R48  10k  [RES 0402/1005]

### Ports
5V, cell0_voltage (bidir), cell1_voltage (bidir), cell2_voltage (bidir), cell3_voltage (bidir), cell4_voltage (bidir), cell5_voltage (bidir), GND, KILL (bidir), MCU_RESET (in), MCU_RX (in), MCU_TX (out), temp_sensor (bidir)

### Nets
5V: ATmega2560.10(VCC) ATmega2560.31(VCC) ATmega2560.61(VCC) ATmega2560.80(VCC) ATmega2560.98(AREF) CONN1.2 D6.2 R47.2 R48.2 ; port 5V
GND: ATmega2560.11(GND) ATmega2560.32(GND) ATmega2560.62(GND) ATmega2560.81(GND) ATmega2560.99(GND) C6.2 C7.2 C8.2 CONN1.1 D7.2 ; port GND
cell0_voltage: ATmega2560.97(PF0_(ADC0)) ; port cell0_voltage
cell1_voltage: ATmega2560.96(PF1_(ADC1)) ; port cell1_voltage
cell2_voltage: ATmega2560.95(PF2_(ADC2)) ; port cell2_voltage
cell3_voltage: ATmega2560.94(PF3_(ADC3)) ; port cell3_voltage
cell4_voltage: ATmega2560.93(PF4_(ADC4/TCK)) ; port cell4_voltage
cell5_voltage: ATmega2560.92(PF5_(ADC5/TMS)) ; port cell5_voltage
KILL: ATmega2560.15(PH3_(OC4A)) ; port KILL
pwm_fan_out: ATmega2560.25(PB6_(OC1B/PCINT6)) CONN1.3
SCL: ATmega2560.43(PD0_(SCL/INT0))
SDA: ATmega2560.44(PD1_(SDA/INT1))
temp_sensor: ATmega2560.91(PF6_(ADC6/TDO)) ; port temp_sensor
NetATmega2560_2: ATmega2560.2(PE0_(RXD0/PCINT8)) ; port MCU_TX
NetATmega2560_3: ATmega2560.3(PE1_(TXD0)) ; port MCU_RX
NetATmega2560_26: ATmega2560.26(PB7_(OC0A/OC1C/PCINT7)) R46.2
NetATmega2560_30: ATmega2560.30(~{RESET}) D6.1 R47.1 ; port MCU_RESET
NetATmega2560_33: ATmega2560.33(XTAL2) C7.1 OS1.1
NetATmega2560_34: ATmega2560.34(XTAL1) C6.1 OS1.2
NetATmega2560_100: ATmega2560.100(AVCC) C8.1 R48.1
NetD7_1: D7.1 R46.1

Not connected (* = marked no-connect by the designer): ATmega2560 1(PG5_(OC0B)) 4(PE2_(XCK0/AIN0)) 5(PE3_(OC3A/AIN1)) 6(PE4_(OC3B/INT4)) 7(PE5_(OC3C/INT5)) 8(PE6_(T3/INT6)) 9(PE7_(CLKO/ICP3/INT7)) 12(PH0_(RXD2)) 13(PH1_(TXD2)) 14(PH2_(XCK2)) 16(PH4_(OC4B)) 17(PH5_(OC4C)) 18(PH6_(OC2B)) 19(PB0_(~{SS}/PCINT0)) 20(PB1_(SCK/PCINT1)) 21(PB2_(MOSI/PCINT2)) 22(PB3_(MISO/PCINT3)) 23(PB4_(OC2A/PCINT4)) 24(PB5_(OC1A/PCINT5)) 27(PH7_(T4)) 28(PG3_(TOSC2)) 29(PG4_(TOSC1)) 35(PL0_(ICP4)) 36(PL1_(ICP5)) 37(PL2_(T5)) 38(PL3_(OC5A)) 39(PL4_(OC5B)) 40(PL5_(OC5C)) 41(PL6) 42(PL7) 45(PD2_(RXD1/INT2)) 46(PD3_(TXD1/INT3)) 47(PD4_(ICP1)) 48(PD5_(XCK1)) 49(PD6_(T1)) 50(PD7_(T0)) 51(PG0_(WR)) 52(PG1_(RD)) 53(PC0_(A8)) 54(PC1_(A9)) 55(PC2_(A10)) 56(PC3_(A11)) 57(PC4_(A12)) 58(PC5_(A13)) 59(PC6_(A14)) 60(PC7_(A15)) 63(PJ0_(RXD3/PCINT9)) 64(PJ1_(TXD3/PCINT10)) 65(PJ2_(XCK3/PCINT11)) 66(PJ3_(PCINT12)) 67(PJ4_(PCINT13)) 68(PJ5_(PCINT14)) 69(PJ6_(PCINT15)) 70(PG2_(ALE)) 71(PA7_(AD7)) 72(PA6_(AD6)) 73(PA5_(AD5)) 74(PA4_(AD4)) 75(PA3_(AD3)) 76(PA2_(AD2)) 77(PA1_(AD1)) 78(PA0_(AD0)) 79(PJ7) 82(PK7_(ADC15/PCINT23)) 83(PK6_(ADC14/PCINT22)) 84(PK5_(ADC13/PCINT21)) 85(PK4_(ADC12/PCINT20)) 86(PK3_(ADC11/PCINT19)) 87(PK2_(ADC10/PCINT18)) 88(PK1_(ADC9/PCINT17)) 89(PK0_(ADC8/PCINT16)) 90(PF7_(ADC7/TDI))

### Notes on the sheet
- Title
- Size:
- Date:
- A4
- Number:
- Time:
- Revision:
- Sheet
- of
- File:

### Library data of the parts
ATmega2560 = ATmega2560-16AU: 8-bit AVR Microcontroller, 4.5-5.5V, 256KB Flash, 4KB EEPROM, 8KB SRAM, 86 GPIO pins, 100-pin TQFP, Industrial Grade (-40°C to 85°C), Pb-Free; Published: 1-Apr-2010; DatasheetVersion: revL, Aug-2007; PackageVersion: revC, Oct-2001; PackageReference: 100A; Publisher: Altium Limited; PackageDescription: 100-Pin Thin Profile Plastic Quad Flat Pack (TQFP), 14 x 14 x 1.0 mm Body, 0.5 mm Pitch; Supplier 1: Digi-Key; Supplier Part Number 1: ATMEGA2560-16AU-ND; Supplier 2: Farnell; Supplier Part Number 2: 1288330; Supplier 3: Farnell; Supplier Part Number 3: 1661740; Supplier 4: Mouser; Supplier Part Number 4: 556-ATMEGA2560-16AU; Code_JEDEC: MS-026-AED; ComponentLink1Description: Manufacturer Link; ComponentLink1URL: http://www.atmel.com/products/avr/default.asp?; ComponentLink2Description: ATmega640/1280/1281/2560/2561 Datasheet; ComponentLink2URL: http://www.atmel.com/dyn/resources/prod_documents/doc2549.pdf; ComponentLink3Description: ATmega640/1280/1281/2560/2561 Summary; ComponentLink3URL: http://www.atmel.com/dyn/resources/prod_documents/2549S.pdf; ComponentLink4Description: Atmel.com Home; ComponentLink4URL: http://www.atmel.com
C6 C7 = C1005X7R1C104K050BC: as C1 on sheet FT232RL_Programmer; Value: 0.1uF; Part Number: C1005X7R1C104K050BC; PartId: 3856; Supplier 1: Digi-Key; Supplier Part Number 1: 445-4952-2-ND; ComponentLink1Description: Datasheet; ComponentLink1URL: https://product.tdk.com/info/en/catalog/datasheets/mlcc_commercial_general_en.pdf; ComponentLink2Description: Digi-Key listing; ComponentLink2URL: http://digikey.com/product-detail/en/C1005X7R1C104K050BC/445-4952-2-ND/2093220; TemperatureCoefficient: X7R; Voltage: 16V; Price: 0.0066; Type: -; Device Package: 0402 (1005 Metric)
C8 = UWX1C330MCL1GB: CAP ALUM 33UF 20% 16V SMD; Manufacturer: Nichicon; TemperatureRange: -40C ~ 85C; Type: General Purpose; Ripple Current: 49mA; Lifetime @ Temp: 2000 Hrs @ 85C; Value: 33uF; Part Number: UWX1C330MCL1GB; PartId: 7190; Supplier 1: Digi-Key; Supplier Part Number 1: 493-2102-2-ND; ComponentLink1Description: Datasheet; ComponentLink1URL: http://nichicon-us.com/english/products/pdfs/e-wx.pdf; ComponentLink2Description: Digi-Key listing; ComponentLink2URL: http://digikey.com/product-detail/en/UWX1C330MCL1GB/493-2102-2-ND/589843; Tolerance: 20%; Voltage: 16V; Price: 0.0916; Device Package: Radial, Can - SMD; Impedance: -
CONN1 = 282834-3: TERM BLOCK 3POS SIDE ENT 2.54MM; Manufacturer: TE Connectivity AMP Connectors; TemperatureRange: -40C ~ 105C; Voltage: 150V; Pitch: 0.100" (2.54mm); Number Of Levels: 1; Positions Per Level: 3; Part Number: 282834-3; PartId: 9290; Supplier 1: Digi-Key; Supplier Part Number 1: A98334-ND; ComponentLink1Description: Datasheet; ComponentLink1URL: http://www.te.com/commerce/DocumentDelivery/DDEController?Action=srchrtrv&DocNm=282834&DocType=Customer+Drawing&DocLang=English; ComponentLink2Description: Digi-Key Listing; ComponentLink2URL: http://www.digikey.ca/product-detail/en/282834-3/A98334-ND/1153264; Price: 2.25; Colour: Green; Orientation: Horizontal with Board
D6 = SMAJ5.0A: as D4 on sheet FT232RL_Programmer; Part Number: SMAJ5.0A; PartId: 7757; Supplier 1: Digi-Key; Supplier Part Number 1: SMAJ5.0ALFTR-ND; ComponentLink1Description: Datasheet; ComponentLink1URL: http://www.littelfuse.com/~/media/electronics/datasheets/tvs_diodes/littelfuse_tvs_diode_smaj_datasheet.pdf.pdf; ComponentLink2Description: Digi-Key Listing; ComponentLink2URL: http://www.digikey.ca/product-detail/en/SMAJ5.0A/SMAJ5.0ALFTR-ND/762250; Operating Temperature: -55C ~ 150C (TJ); Price: 0.1626; Device Package: DO-214AC, SMA
D7 = LTW-C191TS5: LED WHITE 0603 SMD; Manufacturer: Lite-On Inc.; Value: Green; Type: Surface Mount; Millicandela: 112.5mcd; Voltage Forward: 2.93V; Current (Test): 5mA; Viewing Angle: 130; Part Number: LTW-C191TS5; PartId: 7055; Supplier 1: Digi-Key; Supplier Part Number 1: 160-1724-2-ND; ComponentLink1Description: Datasheet; ComponentLink1URL: http://optoelectronics.liteon.com/upload/download/DS22-2004-201/S_110_LTW-C191TS5.pdf; ComponentLink2Description: Digi-Key Listing; ComponentLink2URL: http://www.digikey.ca/product-detail/en/LTW-C191TS5/160-1724-2-ND/726332; Price: 0.1966; Device Package: 0603 (1608 Metric); Colour: White; Lens Transparency: -
OS1 = NX5032GA-10.000M-STD-CSU-1: CRYSTAL 10.0000MHZ 8PF SMD; Manufacturer: NDK; Frequency Stability: 150ppm; Frequency Tolerance: 50ppm; ESR: 150 Ohm; Operating Mode: Fundamental; Part Number: NX5032GA-10.000M-STD-CSU-1; PartId: 8474; Supplier 1: Digi-Key; Supplier Part Number 1: 644-1133-2-ND; ComponentLink1Description: Datasheet; ComponentLink1URL: http://www.ndk.com/images/products/catalog/c_NX5032GA-STD-CSU-2_e.pdf; ComponentLink2Description: Digi-Key Listing; ComponentLink2URL: http://www.digikey.com/product-detail/en/NX5032GA-10.000M-STD-CSU-1/644-1133-2-ND/1788473; Price: 0.63; Type: MHz Crystal; Device Package: 2-SMD; Frequency: 10MHz; Load Capacitance: 8pF
R46-R48 = ERJ-2RKF1002X: as R4 on sheet FT232RL_Programmer; Value: 10k; Part Number: ERJ-2RKF1002X; PartId: 1; Supplier 1: Digi-Key; Supplier Part Number 1: P10.0KLTR-ND; ComponentLink1Description: Datasheet; ComponentLink1URL: http://industrial.panasonic.com/www-cgi/jvcr13pz.cgi?E+PZ+3+AOA0002+ERJ2RKF1002X+7+WW; ComponentLink2Description: Digikey listing; ComponentLink2URL: http://digikey.com/product-detail/en/ERJ-2RKF1002X/P10.0KLTR-ND/192073; Tolerance: 1%; Price: 0.0043; Type: Thick Film; Device Package: 0402 (1005 Metric)

## Sheet PowerRegulator.SchDoc
size A4
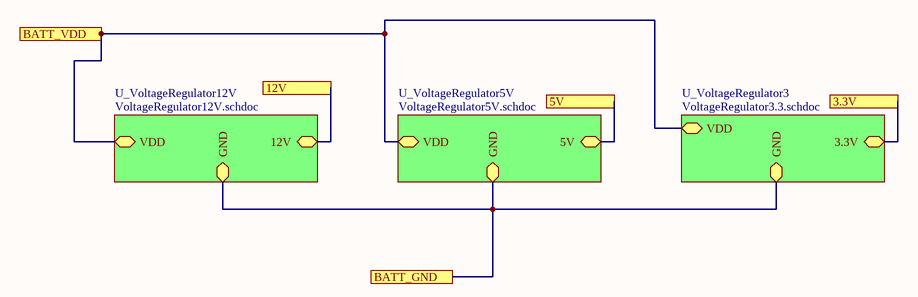
[diagram p7: PowerRegulator.SchDoc]

### Sub-sheets
U_VoltageRegulator3 = VoltageRegulator3.3.schdoc: GND, VDD, 3.3V
U_VoltageRegulator5V = VoltageRegulator5V.schdoc: GND, 5V, VDD
U_VoltageRegulator12V = VoltageRegulator12V.schdoc: GND, 12V, VDD

### Ports
3.3V, 5V, 12V, BATT_GND, BATT_VDD

### Nets
3.3V: port 3.3V, sheet U_VoltageRegulator3/3.3V
5V: port 5V, sheet U_VoltageRegulator5V/5V
12V: port 12V, sheet U_VoltageRegulator12V/12V
BATT_VDD: port BATT_VDD, sheet U_VoltageRegulator12V/VDD, sheet U_VoltageRegulator3/VDD, sheet U_VoltageRegulator5V/VDD
GND: port BATT_GND, sheet U_VoltageRegulator12V/GND, sheet U_VoltageRegulator3/GND, sheet U_VoltageRegulator5V/GND

### Notes on the sheet
- Title
- Size:
- Date:
- A4
- Number:
- Time:
- Revision:
- Sheet
- of
- File:

## Sheet VoltageRegulator12V.schdoc
size A4; SheetNumber: 1; SheetTotal: 1
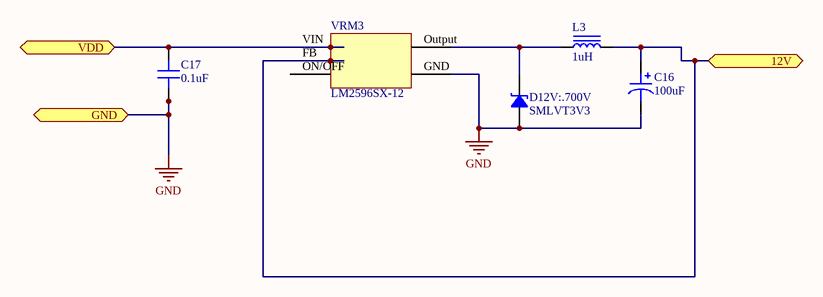
[diagram p8: VoltageRegulator12V.schdoc]

### Parts
C16  100uF  [CAP ALUM 6.6MM]
C17  0.1uF  [CAP 0402/1005]
D12V:.700V  SMLVT3V3  [ST DO214AA SMB]
L3  1uH  [TDK VLS252010CX]
VRM3  LM2596SX-12  [DPAK170P1418X200-6L]

### Ports
12V, GND, VDD

### Nets
12V: C16.1 L3.2 VRM3.FB ; port 12V
BATT_VDD: C17.2 VRM3.VIN(Vin) ; port VDD
GND: C16.2 C17.1 D12V:.700V.1 VRM3.GND ; port GND
NetD12V:.700V_2: D12V:.700V.2 L3.1 VRM3.Output

Not connected (* = marked no-connect by the designer): VRM3 ON/OFF(*)

### Library data of the parts
C16 = 16SVPC100M: CAP POLYMER 100UF 20% 16V SMD; Manufacturer: Panasonic Electronic Components; TemperatureRange: -55C ~ 105C; Ripple Current: 2.49A; Lifetime @ Temp: 2000 Hrs @ 105C; Value: 100uF; Part Number: 16SVPC100M; PartId: 7484; Supplier 1: Digi-Key; Supplier Part Number 1: P16468TR-ND; ComponentLink1Description: Datasheet; ComponentLink1URL: http://industrial.panasonic.com/www-cgi/jvcr13pz.cgi?E+CI+4+AAB8004+16SVPC100M+8+WW; ComponentLink2Description: Digi-Key listing; ComponentLink2URL: http://digikey.com/product-detail/en/16SVPC100M/P16468TR-ND/4204800; Tolerance: 20%; Voltage: 16V; Price: 0.4169; Type: -; Device Package: Radial, Can - SMD; Impedance: -
C17 = C1005X7R1C104K050BC: as C1 on sheet FT232RL_Programmer; Value: 0.1uF; Part Number: C1005X7R1C104K050BC; PartId: 3856; Supplier 1: Digi-Key; Supplier Part Number 1: 445-4952-2-ND; ComponentLink1Description: Datasheet; ComponentLink1URL: https://product.tdk.com/info/en/catalog/datasheets/mlcc_commercial_general_en.pdf; ComponentLink2Description: Digi-Key listing; ComponentLink2URL: http://digikey.com/product-detail/en/C1005X7R1C104K050BC/445-4952-2-ND/2093220; TemperatureCoefficient: X7R; Voltage: 16V; Price: 0.0066; Type: -; Device Package: 0402 (1005 Metric)
D12V:.700V = SMLVT3V3: TVS DIODE 3.3VWM 10.3VC SMB; Manufacturer: STMicroelectronics; Type: Zener; Unidirectional Channels: 1; Power - Peak Pulse: 600W; Current - Peak Pulse: 200A (8/20us); Voltage (Clamping): 10.3V; Voltage (Breakdown): 4.1V; Voltage (Reverse Standoff): 3.3V; Capacitance @ Frequency: 5200pF @ 1MHz; Part Number: SMLVT3V3; PartId: 14618; Supplier 1: Digi-Key; Supplier Part Number 1: 497-2496-2-ND; ComponentLink1Description: Datasheet; ComponentLink1URL: http://www.st.com/web/en/resource/technical/document/datasheet/CD00000923.pdf; ComponentLink2Description: Digi-Key Listing; ComponentLink2URL: https://www.digikey.com/product-detail/en/stmicroelectronics/SMLVT3V3/497-2496-2-ND/603521; Operating Temperature: -25C ~ 175C (TJ); Price: 0.2247; Device Package: DO-214AA, SMB
L3 = VLS252010CX-1R0M: FIXED IND 1UH 2.29A 65 MOHM SMD; Manufacturer: TDK Corporation; Type: Wirewound; Tolerance: 20%; Shielding: Shielded; DC Resistance (DCR): 65 mOhm Max; Value: 1uH; Part Number: VLS252010CX-1R0M; PartId: 9466; Supplier 1: Digi-Key; Supplier Part Number 1: 445-172969-2-ND; ComponentLink1Description: Datasheet; ComponentLink1URL: https://product.tdk.com/info/en/catalog/datasheets/inductor_commercial_power_vls252010cx_en.pdf; ComponentLink2Description: Digi-Key Listing; ComponentLink2URL: https://www.digikey.com/product-detail/en/VLS252010CX-1R0M/445-172969-2-ND/5169774; Price: 0.1785; Device Package: Nonstandard; Series: VLS-CX; Inductance: 1uH; Current Rating: 2.29A; Q @ Freq: -; Frequency - Self Resonant: -; Operating Temperature: -40C ~ 105C

## Sheet VoltageRegulator3.3.schdoc
size A4; SheetNumber: 1; SheetTotal: 1
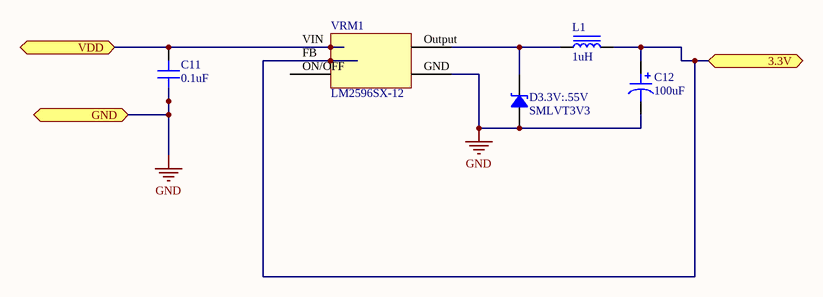
[diagram p9: VoltageRegulator3.3.schdoc]

### Parts
C11  0.1uF  [CAP 0402/1005]
C12  100uF  [CAP ALUM 6.6MM]
D3.3V:.55V  SMLVT3V3  [ST DO214AA SMB]
L1  1uH  [TDK VLS252010CX]
VRM1  LM2596SX-12  [DPAK170P1418X200-6L]

### Ports
3.3V, GND, VDD

### Nets
3.3V: C12.1 L1.2 VRM1.FB ; port 3.3V
BATT_VDD: C11.2 VRM1.VIN(Vin) ; port VDD
GND: C11.1 C12.2 D3.3V:.55V.1 VRM1.GND ; port GND
NetD3.3V:.55V_2: D3.3V:.55V.2 L1.1 VRM1.Output

Not connected (* = marked no-connect by the designer): VRM1 ON/OFF(*)

### Notes on the sheet
- Title
- Size:
- Date:
- A4
- Number:
- Time:
- Revision:
- Sheet
- of
- File:

### Library data of the parts
C11 = C1005X7R1C104K050BC: as C1 on sheet FT232RL_Programmer; Value: 0.1uF; Part Number: C1005X7R1C104K050BC; PartId: 3856; Supplier 1: Digi-Key; Supplier Part Number 1: 445-4952-2-ND; ComponentLink1Description: Datasheet; ComponentLink1URL: https://product.tdk.com/info/en/catalog/datasheets/mlcc_commercial_general_en.pdf; ComponentLink2Description: Digi-Key listing; ComponentLink2URL: http://digikey.com/product-detail/en/C1005X7R1C104K050BC/445-4952-2-ND/2093220; TemperatureCoefficient: X7R; Voltage: 16V; Price: 0.0066; Type: -; Device Package: 0402 (1005 Metric)
C12 = 16SVPC100M: as C16 on sheet VoltageRegulator12V; Value: 100uF; Part Number: 16SVPC100M; PartId: 7484; Supplier 1: Digi-Key; Supplier Part Number 1: P16468TR-ND; ComponentLink1Description: Datasheet; ComponentLink1URL: http://industrial.panasonic.com/www-cgi/jvcr13pz.cgi?E+CI+4+AAB8004+16SVPC100M+8+WW; ComponentLink2Description: Digi-Key listing; ComponentLink2URL: http://digikey.com/product-detail/en/16SVPC100M/P16468TR-ND/4204800; Tolerance: 20%; Voltage: 16V; Price: 0.4169; Type: -; Device Package: Radial, Can - SMD; Impedance: -
D3.3V:.55V = SMLVT3V3: as D12V:.700V on sheet VoltageRegulator12V; Part Number: SMLVT3V3; PartId: 14618; Supplier 1: Digi-Key; Supplier Part Number 1: 497-2496-2-ND; ComponentLink1Description: Datasheet; ComponentLink1URL: http://www.st.com/web/en/resource/technical/document/datasheet/CD00000923.pdf; ComponentLink2Description: Digi-Key Listing; ComponentLink2URL: https://www.digikey.com/product-detail/en/stmicroelectronics/SMLVT3V3/497-2496-2-ND/603521; Operating Temperature: -25C ~ 175C (TJ); Price: 0.2247; Device Package: DO-214AA, SMB
L1 = VLS252010CX-1R0M: as L3 on sheet VoltageRegulator12V; Value: 1uH; Part Number: VLS252010CX-1R0M; PartId: 9466; Supplier 1: Digi-Key; Supplier Part Number 1: 445-172969-2-ND; ComponentLink1Description: Datasheet; ComponentLink1URL: https://product.tdk.com/info/en/catalog/datasheets/inductor_commercial_power_vls252010cx_en.pdf; ComponentLink2Description: Digi-Key Listing; ComponentLink2URL: https://www.digikey.com/product-detail/en/VLS252010CX-1R0M/445-172969-2-ND/5169774; Price: 0.1785; Device Package: Nonstandard; Series: VLS-CX; Inductance: 1uH; Current Rating: 2.29A; Q @ Freq: -; Frequency - Self Resonant: -; Operating Temperature: -40C ~ 105C

## Sheet VoltageRegulator5V.schdoc
size A4; SheetNumber: 1; SheetTotal: 1
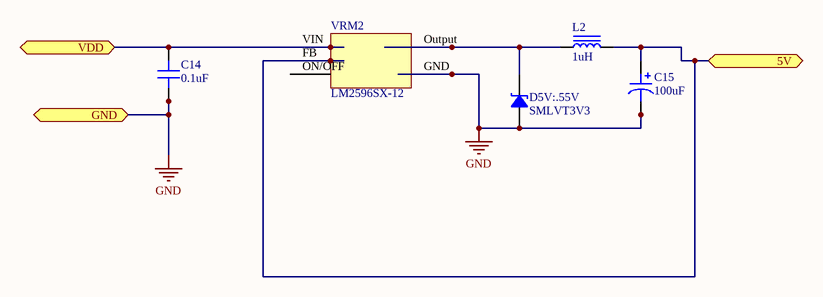
[diagram p10: VoltageRegulator5V.schdoc]

### Parts
C14  0.1uF  [CAP 0402/1005]
C15  100uF  [CAP ALUM 6.6MM]
D5V:.55V  SMLVT3V3  [ST DO214AA SMB]
L2  1uH  [TDK VLS252010CX]
VRM2  LM2596SX-12  [DPAK170P1418X200-6L]

### Ports
5V, GND, VDD

### Nets
5V: C15.1 L2.2 VRM2.FB ; port 5V
BATT_VDD: C14.2 VRM2.VIN(Vin) ; port VDD
GND: C14.1 C15.2 D5V:.55V.1 VRM2.GND ; port GND
NetD5V:.55V_2: D5V:.55V.2 L2.1 VRM2.Output

Not connected (* = marked no-connect by the designer): VRM2 ON/OFF(*)

### Notes on the sheet
- Title
- Size:
- Date:
- A4
- Number:
- Time:
- Revision:
- Sheet
- of
- File:

### Library data of the parts
C14 = C1005X7R1C104K050BC: as C1 on sheet FT232RL_Programmer; Value: 0.1uF; Part Number: C1005X7R1C104K050BC; PartId: 3856; Supplier 1: Digi-Key; Supplier Part Number 1: 445-4952-2-ND; ComponentLink1Description: Datasheet; ComponentLink1URL: https://product.tdk.com/info/en/catalog/datasheets/mlcc_commercial_general_en.pdf; ComponentLink2Description: Digi-Key listing; ComponentLink2URL: http://digikey.com/product-detail/en/C1005X7R1C104K050BC/445-4952-2-ND/2093220; TemperatureCoefficient: X7R; Voltage: 16V; Price: 0.0066; Type: -; Device Package: 0402 (1005 Metric)
C15 = 16SVPC100M: as C16 on sheet VoltageRegulator12V; Value: 100uF; Part Number: 16SVPC100M; PartId: 7484; Supplier 1: Digi-Key; Supplier Part Number 1: P16468TR-ND; ComponentLink1Description: Datasheet; ComponentLink1URL: http://industrial.panasonic.com/www-cgi/jvcr13pz.cgi?E+CI+4+AAB8004+16SVPC100M+8+WW; ComponentLink2Description: Digi-Key listing; ComponentLink2URL: http://digikey.com/product-detail/en/16SVPC100M/P16468TR-ND/4204800; Tolerance: 20%; Voltage: 16V; Price: 0.4169; Type: -; Device Package: Radial, Can - SMD; Impedance: -
D5V:.55V = SMLVT3V3: as D12V:.700V on sheet VoltageRegulator12V; Part Number: SMLVT3V3; PartId: 14618; Supplier 1: Digi-Key; Supplier Part Number 1: 497-2496-2-ND; ComponentLink1Description: Datasheet; ComponentLink1URL: http://www.st.com/web/en/resource/technical/document/datasheet/CD00000923.pdf; ComponentLink2Description: Digi-Key Listing; ComponentLink2URL: https://www.digikey.com/product-detail/en/stmicroelectronics/SMLVT3V3/497-2496-2-ND/603521; Operating Temperature: -25C ~ 175C (TJ); Price: 0.2247; Device Package: DO-214AA, SMB
L2 = VLS252010CX-1R0M: as L3 on sheet VoltageRegulator12V; Value: 1uH; Part Number: VLS252010CX-1R0M; PartId: 9466; Supplier 1: Digi-Key; Supplier Part Number 1: 445-172969-2-ND; ComponentLink1Description: Datasheet; ComponentLink1URL: https://product.tdk.com/info/en/catalog/datasheets/inductor_commercial_power_vls252010cx_en.pdf; ComponentLink2Description: Digi-Key Listing; ComponentLink2URL: https://www.digikey.com/product-detail/en/VLS252010CX-1R0M/445-172969-2-ND/5169774; Price: 0.1785; Device Package: Nonstandard; Series: VLS-CX; Inductance: 1uH; Current Rating: 2.29A; Q @ Freq: -; Frequency - Self Resonant: -; Operating Temperature: -40C ~ 105C

## Nets that join several sheets
3.3V: BackplaneConnector (6 pins), VoltageRegulator3.3 (C12.1 L1.2 VRM1.FB)
5V: KillSwitch (R3.2), Motor (PWM_BL.2 PWM_BR.2 PWM_FL.2 PWM_FR.2), FT232RL_Programmer (R6.1 R7.1 R8.1 R9.2), BackplaneConnector (10 pins), Atmega2560 (9 pins), VoltageRegulator5V (C15.1 L2.2 VRM2.FB)
12V: BackplaneConnector (86 pins), VoltageRegulator12V (C16.1 L3.2 VRM3.FB)
BATT_VDD: KillSwitch (6 pins), VoltageRegulator12V (C17.2 VRM3.VIN), VoltageRegulator3.3 (C11.2 VRM1.VIN), VoltageRegulator5V (C14.2 VRM2.VIN)
GND: KillSwitch (T1.2), Motor (8 pins), FT232RL_Programmer (12 pins), BackplaneConnector (114 pins), Atmega2560 (10 pins), VoltageRegulator12V (C16.2 C17.1 D12V:.700V.1 VRM3.GND), VoltageRegulator3.3 (C11.1 C12.2 D3.3V:.55V.1 VRM1.GND), VoltageRegulator5V (C14.1 C15.2 D5V:.55V.1 VRM2.GND)
KILL: KillSwitch (R3.1 T1.1), BackplaneConnector (Flight.A4 Flight.B4 Jetson.A4 Jetson.B4), Atmega2560 (ATmega2560.15)
Motor_BL_Postive: KillSwitch (T4.2), Motor (FUES_FR.SRC)
MOTOR_BL_PWM: Motor (PWM_BL.3), BackplaneConnector (Flight.A39 Jetson.A39)
Motor_BR_Postive: KillSwitch (T5.2), Motor (FUES_FL.SRC)
MOTOR_BR_PWM: Motor (PWM_FL.3), BackplaneConnector (Flight.B41 Jetson.B41)
Motor_FL_Postive: KillSwitch (T3.2), Motor (FUES_BR.SRC)
MOTOR_FL_PWM: Motor (PWM_FR.3), BackplaneConnector (Flight.B42 Jetson.B42)
Motor_FR_Postive: KillSwitch (T2.2), Motor (FUES_BL.SRC)
MOTOR_FR_PWM: Motor (PWM_BR.3), BackplaneConnector (Flight.B44 Jetson.B44)
NetATmega2560_2: FT232RL_Programmer (R5.2), Atmega2560 (ATmega2560.2)
NetATmega2560_3: FT232RL_Programmer (R4.2), Atmega2560 (ATmega2560.3)
NetATmega2560_30: FT232RL_Programmer (C4.2 R9.1 Reset.3 Reset.4), Atmega2560 (ATmega2560.30 D6.1 R47.1)